# EAGLE design mainboard-mini (EAGLE 6.4)
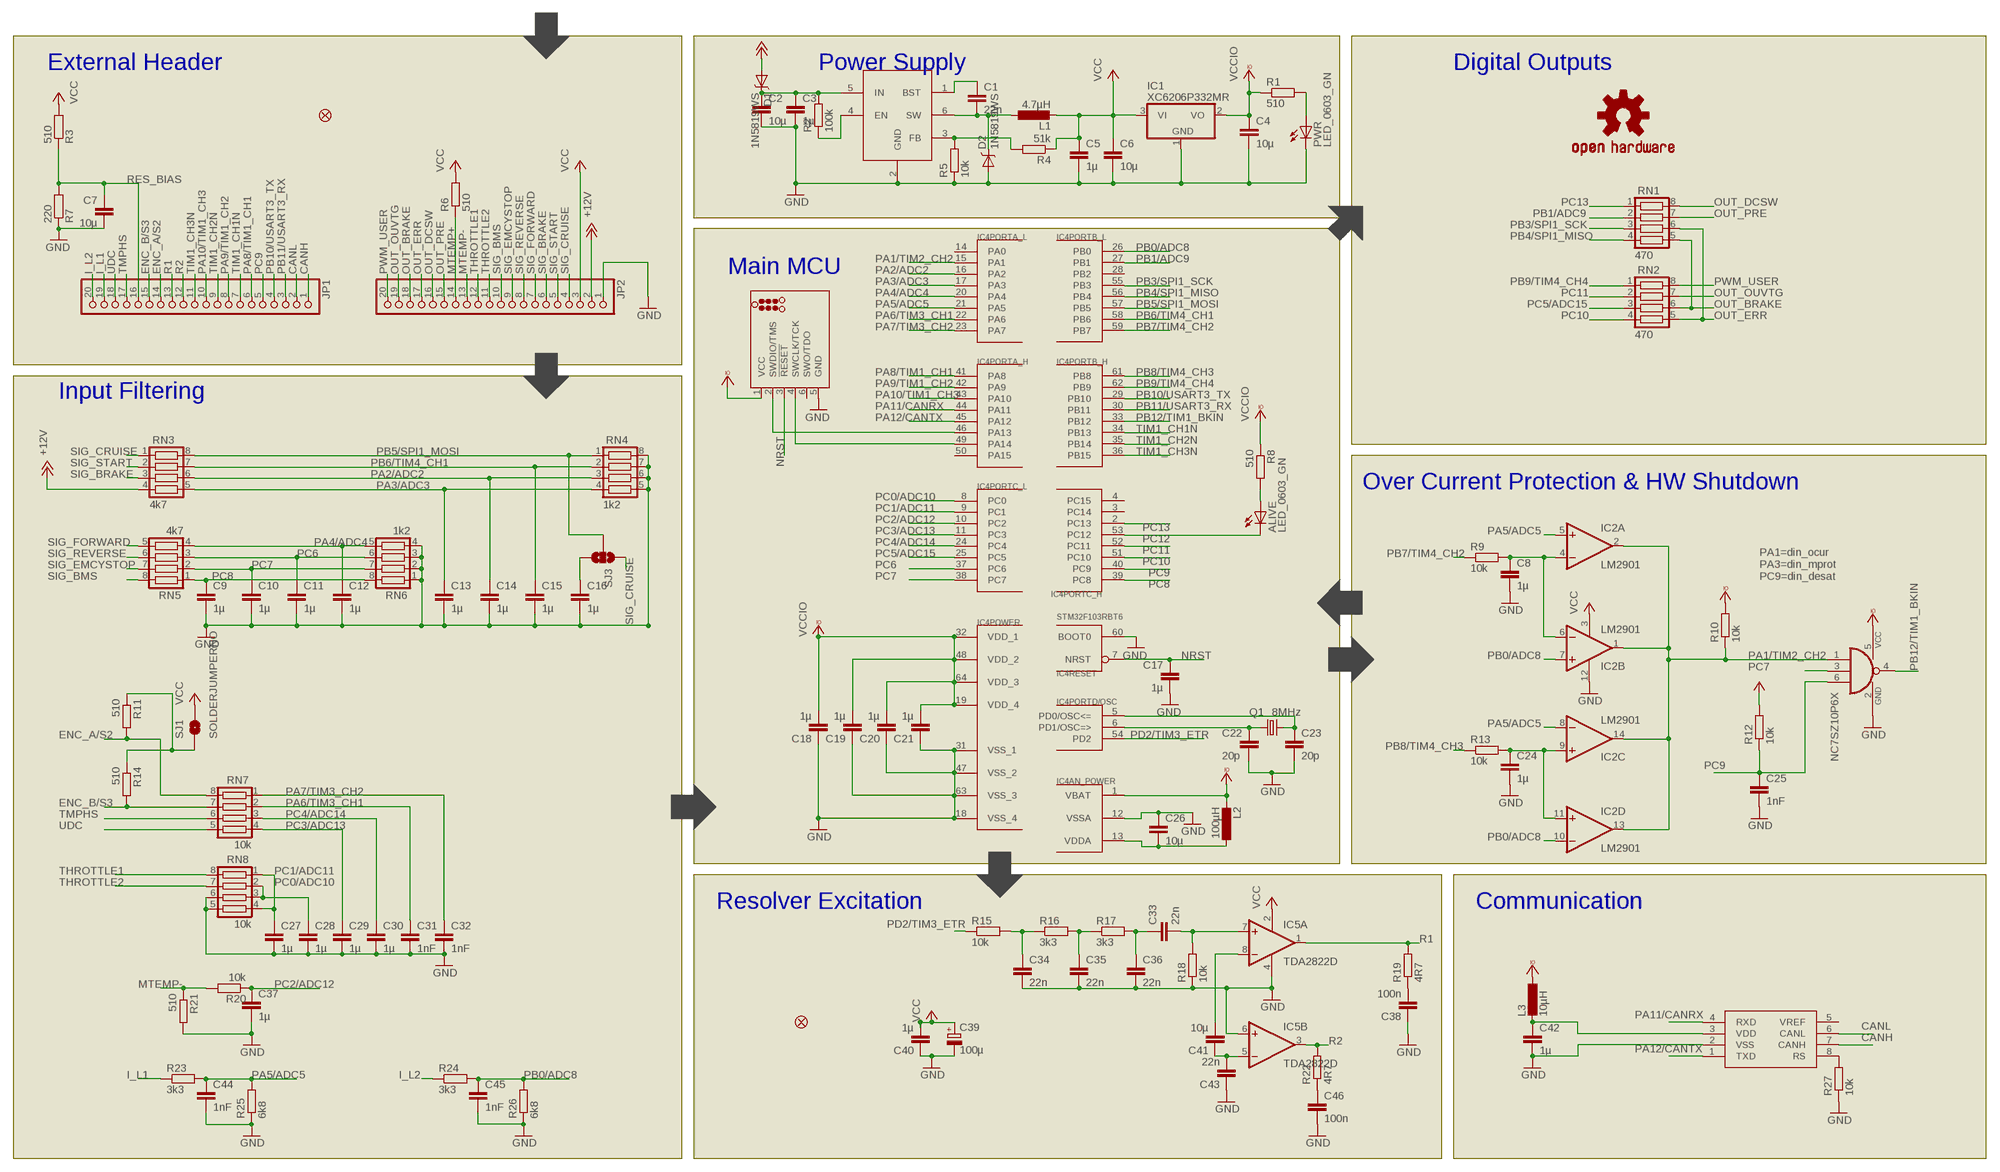
[diagram p0: schematic, sheet 1]

## Parts
ALIVE  LED_0603_GN  LEDSML0805  [SML0805]
C1  22n  C-EUC0603  [C0603]
C2  10µ  C-EUC0603  [C0603]
C3  1µ  C-EUC0603  [C0603]
C4  10µ  C-EUC0603  [C0603]
C5  1µ  C-EUC0603  [C0603]
C6  10µ  C-EUC0603  [C0603]
C7  10µ  C-EUC0603  [C0603]
C8  1µ  C-EUC0603  [C0603]
C9  1µ  C-EUC0603  [C0603]
C10  1µ  C-EUC0603  [C0603]
C11  1µ  C-EUC0603  [C0603]
C12  1µ  C-EUC0603  [C0603]
C13  1µ  C-EUC0603  [C0603]
C14  1µ  C-EUC0603  [C0603]
C15  1µ  C-EUC0603  [C0603]
C16  1µ  C-EUC0603  [C0603]
C17  1µ  C-EUC0603  [C0603]
C18  1µ  C-EUC0603  [C0603]
C19  1µ  C-EUC0603  [C0603]
C20  1µ  C-EUC0603  [C0603]
C21  1µ  C-EUC0603  [C0603]
C22  20p  C-EUC0603  [C0603]
C23  20p  C-EUC0603  [C0603]
C24  1µ  C-EUC0603  [C0603]
C25  1nF  C-EUC0603  [C0603]
C26  10µ  C-EUC0603  [C0603]
C27  1µ  C-EUC0603  [C0603]
C28  1µ  C-EUC0603  [C0603]
C29  1µ  C-EUC0603  [C0603]
C30  1µ  C-EUC0603  [C0603]
C31  1nF  C-EUC0603  [C0603]
C32  1nF  C-EUC0603  [C0603]
C33  22n  C-EUC0603  [C0603]
C34  22n  C-EUC0603  [C0603]
C35  22n  C-EUC0603  [C0603]
C36  22n  C-EUC0603  [C0603]
C37  1µ  C-EUC0603  [C0603]
C38  100n  C-EUC0603  [C0603]
C39  100µ  CPOL-EUB/3528-21R  [B/3528-21R]
C40  1µ  C-EUC0603  [C0603]
C41  10µ  C-EUC0603  [C0603]
C42  1µ  C-EUC0603  [C0603]
C43  22n  C-EUC0603  [C0603]
C44  1nF  C-EUC0603  [C0603]
C45  1nF  C-EUC0603  [C0603]
C46  100n  C-EUC0603  [C0603]
D1  1N5819WS  BAT20JFILM  [SOD-323]
D2  1N5819WS  BAT20JFILM  [SOD-323]
FID1  FIDUCIAL1X2.5  [FIDUCIAL-1X2.5]
FID2  FIDUCIAL1X2.5  [FIDUCIAL-1X2.5]
IC1  XC6206P332MR  MCP1703CB  [SOT23]
IC2  LM2901  LM339D  [SO14]
IC3  NC7SZ10P6X  741G10X  [SC70-6]
IC4  STM32F103RBT6  STM32F10XRXT6  [TQFP64]
IC5  TDA2822D  [SO08]
IC6  SN65HVD230  MCP2551  [SO08]
IC7  RT8259GE  MB2359DJ  [SOT23-6]
J1  TC2030_SWD-MCP  [TC2030-MCP]
JP1  PINHD-1X20  [1X20]
JP2  PINHD-1X20  [1X20]
L1  4.7µH  L-EUL2825P  [L2825P]
L2  100µH  L-EUL2012C  [L2012C]
L3  10µH  L-EUL2012C  [L2012C]
LOGO1  OSHW-LOGOM  [OSHW-LOGO-M]
PWR  LED_0603_GN  LEDSML0805  [SML0805]
Q1  8MHz  CRYSTALTXC-7A  [CRYSTAL-TXC-7A]
R1  510  R-EU_R0603  [R0603]
R2  100k  R-EU_R0603  [R0603]
R3  510  R-EU_R0603  [R0603]
R4  51k  R-EU_R0603  [R0603]
R5  10k  R-EU_R0603  [R0603]
R6  510  R-EU_R0603  [R0603]
R7  220  R-EU_R0603  [R0603]
R8  510  R-EU_R0603  [R0603]
R9  10k  R-EU_R0603  [R0603]
R10  10k  R-EU_R0603  [R0603]
R11  510  R-EU_R0603  [R0603]
R12  10k  R-EU_R0603  [R0603]
R13  10k  R-EU_R0603  [R0603]
R14  510  R-EU_R0603  [R0603]
R15  10k  R-EU_R0603  [R0603]
R16  3k3  R-EU_R0603  [R0603]
R17  3k3  R-EU_R0603  [R0603]
R18  10k  R-EU_R0603  [R0603]
R19  4R7  R-EU_R0603  [R0603]
R20  10k  R-EU_R0603  [R0603]
R21  510  R-EU_R0603  [R0603]
R22  4R7  R-EU_R0603  [R0603]
R23  3k3  R-EU_R0603  [R0603]
R24  3k3  R-EU_R0603  [R0603]
R25  6k8  R-EU_R0603  [R0603]
R26  6k8  R-EU_R0603  [R0603]
R27  10k  R-EU_R0603  [R0603]
RN1  470  CTS742C083  [CTS742C083]
RN2  470  CTS742C083  [CTS742C083]
RN3  4k7  CTS742C083  [CTS742C083]
RN4  1k2  CTS742C083  [CTS742C083]
RN5  4k7  CTS742C083  [CTS742C083]
RN6  1k2  CTS742C083  [CTS742C083]
RN7  10k  CTS742C083  [CTS742C083]
RN8  10k  CTS742C083  [CTS742C083]
SJ1  SOLDERJUMPERNO  [SJ_2S-NO]
SJ3  SOLDERJUMPER_2WAYPASTE2&3  [SJ_3_PASTE2&3]

## Nets
+12V: D1.2(A) JP2.2 RN3.4
CANH: IC6.7(CANH) JP1.1
CANL: IC6.6(CANL) JP1.2
ENC_A/S2: JP1.14 R11.2 RN7.8
ENC_B/S3: JP1.15 R14.2 RN7.7
GND: C2.2 C3.2 C4.2 C5.2 C6.2 C7.2 C8.2 C9.2 C10.2 C11.2 C12.2 C13.2 C14.2 C15.2 C16.2 C17.2 C18.1 C19.1 C20.1 C21.1 C22.2 C23.2 C24.2 C25.2 C26.1 C27.2 C28.2 C29.2 C30.2 C31.2 C32.2 C34.2 C35.2 C36.2 C37.2 C38.1 C39.- C40.1 C42.2 C43.1 C44.2 C45.2 C46.2 D2.2(A) IC1.1(GND) IC2.12(P:GND) IC3.2(PWR:GND) IC4.12(AN_POWER:VSSA) IC4.18(POWER:VSS_4) IC4.31(POWER:VSS_1) IC4.47(POWER:VSS_2) IC4.60(RESET:BOOT0) IC4.63(POWER:VSS_3) IC5.4(P:V-) IC5.6(B:+IN) IC6.2(VSS) IC7.2(GND) J1.5(GND) JP2.1 PWR.C R5.1 R7.1 R18.1 R21.2 R25.1 R26.1 R27.1 RN4.5 RN4.6 RN4.7 RN4.8 RN6.1 RN6.2 RN6.3 RN6.4 RN8.5 RN8.6
I_L1: JP1.19 R23.1
I_L2: JP1.20 R24.1
MTEMP+: JP2.14 R6.1
MTEMP-: JP2.13 R20.2 R21.1
N$1: C41.1 C43.2 IC5.5(B:-IN)
N$2: C22.1 IC4.6(PORTD/OSC:PD1/OSC=>) Q1.P$1
N$3: C2.1 C3.1 D1.1(C) IC7.5(IN) R2.2
N$4: C23.1 IC4.5(PORTD/OSC:PD0/OSC<=) Q1.P$2
N$5: C1.1 IC7.1(BST)
N$6: IC4.46(PORTA_H:PA13) J1.2(SWDIO/TMS)
N$7: C26.2 IC4.13(AN_POWER:VDDA) L2.1
N$8: IC7.4(EN) R2.1
N$9: IC4.49(PORTA_H:PA14) J1.4(SWCLK/TCK)
N$10: C24.1 IC2.9(C:+IN) IC2.11(D:+IN) R13.2
N$11: C38.2 R19.1
N$12: C41.2 IC5.8(A:-IN)
N$13: IC7.3(FB) R4.2 R5.2
N$14: C1.2 D2.1(C) IC7.6(SW) L1.1
N$15: C8.1 IC2.4(A:-IN) IC2.6(B:-IN) R9.2
N$16: C42.1 IC6.3(VDD) L3.2
N$17: C35.1 R16.2 R17.1
N$18: C33.1 C36.1 R17.2
N$19: C33.2 IC5.7(A:+IN) R18.2
N$20: R11.1 R14.1 SJ1.1
N$21: C16.1 SJ3.3
N$22: PWR.A R1.2
N$23: ALIVE.A R8.2
N$24: IC6.8(RS) R27.2
N$27: C46.1 R22.1
N$30: C34.1 R15.2 R16.1
NRST: C17.1 IC4.7(RESET:NRST) J1.3(!RESET)
OUT_BRAKE: JP2.18 RN1.5 RN2.6
OUT_DCSW: JP2.16 RN1.8
OUT_ERR: JP2.17 RN1.6 RN2.5
OUT_OUVTG: JP2.19 RN2.7
OUT_PRE: JP2.15 RN1.7
PA1/TIM2_CH2: IC2.1(B:OUT) IC2.2(A:OUT) IC2.13(D:OUT) IC2.14(C:OUT) IC3.1(>NAME:I0) IC4.15(PORTA_L:PA1) R10.1
PA2/ADC2: C14.1 IC4.16(PORTA_L:PA2) RN3.6 RN4.3
PA3/ADC3: C13.1 IC4.17(PORTA_L:PA3) RN3.5 RN4.4
PA4/ADC4: C12.1 IC4.20(PORTA_L:PA4) RN5.4 RN6.5
PA5/ADC5: C44.1 IC2.5(A:+IN) IC2.8(C:-IN) IC4.21(PORTA_L:PA5) R23.2 R25.2
PA6/TIM3_CH1: C31.1 IC4.22(PORTA_L:PA6) RN7.2
PA7/TIM3_CH2: C32.1 IC4.23(PORTA_L:PA7) RN7.1
PA8/TIM1_CH1: IC4.41(PORTA_H:PA8) JP1.6
PA9/TIM1_CH2: IC4.42(PORTA_H:PA9) JP1.8
PA10/TIM1_CH3: IC4.43(PORTA_H:PA10) JP1.10
PA11/CANRX: IC4.44(PORTA_H:PA11) IC6.4(RXD)
PA12/CANTX: IC4.45(PORTA_H:PA12) IC6.1(TXD)
PB0/ADC8: C45.1 IC2.7(B:+IN) IC2.10(D:-IN) IC4.26(PORTB_L:PB0) R24.2 R26.2
PB1/ADC9: IC4.27(PORTB_L:PB1) RN1.2
PB3/SPI1_SCK: IC4.55(PORTB_L:PB3) RN1.3
PB4/SPI1_MISO: IC4.56(PORTB_L:PB4) RN1.4
PB5/SPI1_MOSI: IC4.57(PORTB_L:PB5) RN3.8 RN4.1 SJ3.2
PB6/TIM4_CH1: C15.1 IC4.58(PORTB_L:PB6) RN3.7 RN4.2
PB7/TIM4_CH2: IC4.59(PORTB_L:PB7) R9.1
PB8/TIM4_CH3: IC4.61(PORTB_H:PB8) R13.1
PB9/TIM4_CH4: IC4.62(PORTB_H:PB9) RN2.1
PB10/USART3_TX: IC4.29(PORTB_H:PB10) JP1.4
PB11/USART3_RX: IC4.30(PORTB_H:PB11) JP1.3
PB12/TIM1_BKIN: IC3.4(>NAME:O) IC4.33(PORTB_H:PB12)
PC0/ADC10: C28.1 IC4.8(PORTC_L:PC0) RN8.2 RN8.3
PC1/ADC11: C27.1 IC4.9(PORTC_L:PC1) RN8.1 RN8.4
PC2/ADC12: C37.1 IC4.10(PORTC_L:PC2) R20.1
PC3/ADC13: C29.1 IC4.11(PORTC_L:PC3) RN7.4
PC4/ADC14: C30.1 IC4.24(PORTC_L:PC4) RN7.3
PC5/ADC15: IC4.25(PORTC_L:PC5) RN2.3
PC6: C11.1 IC4.37(PORTC_L:PC6) RN5.3 RN6.6
PC7: C10.1 IC3.3(>NAME:I1) IC4.38(PORTC_L:PC7) RN5.2 RN6.7
PC8: C9.1 IC4.39(PORTC_H:PC8) RN5.1 RN6.8
PC9: C25.1 IC3.6(>NAME:I2) IC4.40(PORTC_H:PC9) JP1.5 R12.1
PC10: IC4.51(PORTC_H:PC10) RN2.4
PC11: IC4.52(PORTC_H:PC11) RN2.2
PC12: ALIVE.C IC4.53(PORTC_H:PC12)
PC13: IC4.2(PORTC_H:PC13) RN1.1
PD2/TIM3_ETR: IC4.54(PORTD/OSC:PD2) R15.1
PWM_USER: JP2.20 RN2.8
R1: IC5.1(A:OUT) JP1.13 R19.2
R2: IC5.3(B:OUT) JP1.12 R22.2
RES_BIAS: C7.1 JP1.16 R3.1 R7.2
SIG_BMS: JP2.10 RN5.8
SIG_BRAKE: JP2.6 RN3.3
SIG_CRUISE: JP2.4 RN3.1 SJ3.1
SIG_EMCYSTOP: JP2.9 RN5.7
SIG_FORWARD: JP2.7 RN5.5
SIG_REVERSE: JP2.8 RN5.6
SIG_START: JP2.5 RN3.2
THROTTLE1: JP2.12 RN8.8
THROTTLE2: JP2.11 RN8.7
TIM1_CH1N: IC4.34(PORTB_H:PB13) JP1.7
TIM1_CH2N: IC4.35(PORTB_H:PB14) JP1.9
TIM1_CH3N: IC4.36(PORTB_H:PB15) JP1.11
TMPHS: JP1.17 RN7.6
UDC: JP1.18 RN7.5
VCC: C5.1 C6.1 C39.+ C40.2 IC1.3(VI) IC2.3(P:V+) IC5.2(P:V+) JP2.3 L1.2 R3.2 R4.1 R6.2 R12.2 SJ1.2
VCCIO: C4.1 C18.2 C19.2 C20.2 C21.2 IC1.2(VO) IC3.5(PWR:VCC) IC4.1(AN_POWER:VBAT) IC4.19(POWER:VDD_4) IC4.32(POWER:VDD_1) IC4.48(POWER:VDD_2) IC4.64(POWER:VDD_3) J1.1(VCC) L2.2 L3.1 R1.1 R8.1 R10.2
Unconnected: IC4.3(PORTC_H:PC14) IC4.4(PORTC_H:PC15) IC4.14(PORTA_L:PA0) IC4.28(PORTB_L:PB2) IC4.50(PORTA_H:PA15) IC6.5(VREF) J1.6(SWO/TDO)

## Notes on the sheet
- External Header | Power Supply | Digital Outputs
- Main MCU
- Input Filtering
- Over Current Protection & HW Shutdown
- PA1=din_ocur
  PA3=din_mprot
  PC9=din_desat
- Resolver Excitation | Communication

## Library data of the parts
ALIVE PWR = led:LED: LED OSRAM: - CHIPLED LG R971, LG N971, LY N971, LG Q971, LY Q971, LO R971, LY R971 LH N974, LH R974 LS Q976, LO Q976, LY Q976 LO Q996 - Hyper CHIPLED LW Q18S LB Q993, LB Q99A, LB R99A - SideLED LS A670, LO A670, LY A670, LG A670, LP A670 LB A673, LV A673, LT A673, LW A673 LH A674 LY A675 LS A676, LA A676, LO A676, LY A676, LW A676 LS A679, LY A679, LG A679 - Hyper Micro SIDELED® LS Y876, LA Y876, LO Y876, LY Y876 LT Y87S - SmartLED LW L88C, LW L88S LB L89C, LB L89S, LG L890 LS L89K, LO L89K, LY L89K LS L896, LA L896, LO L896, LY L896 - TOPLED LS T670, LO T670, LY T670, LG T670, LP T670 LSG T670, LSP T670, LSY T670, LOP T670, LYG T670 LG T671, LOG T671, LSG T671 LB T673, LV T673, LT T673, LW T673 LH T674 LS T676, LA T676, LO T676, LY T676, LB T676, LH T676, LSB T676, LW T676 LB T67C, LV T67C, LT T67C, LS T67K, LO T67K, LY T67K, LW E67C LS E67B, LA E67B, LO E67B, LY E67B, LB E67C, LV E67C, LT E67C LW T67C LS T679, LY T679, LG T679 LS T770, LO T770, LY T770, LG T770, LP T770 LB T773, LV T773, LT T773, LW T773 LH T774 LS E675, LA E675, LY E675, LS T675 LS T776, LA T776, LO T776, LY T776, LB T776 LHGB T686 LT T68C, LB T68C - Hyper Mini TOPLED® LB M676 - Mini TOPLED Santana® LG M470 LS M47K, LO M47K, LY M47K Source: http://www.osram.convergy.de LUXEON: - LUMILED® LXK2-PW12-R00, LXK2-PW12-S00, LXK2-PW14-U00, LXK2-PW14-V00 LXK2-PM12-R00, LXK2-PM12-S00, LXK2-PM14-U00 LXK2-PE12-Q00, LXK2-PE12-R00, LXK2-PE12-S00, LXK2-PE14-T00, LXK2-PE14-U00 LXK2-PB12-K00, LXK2-PB12-L00, LXK2-PB12-M00, LXK2-PB14-N00, LXK2-PB14-P00, LXK2-PB14-Q00 LXK2-PR12-L00, LXK2-PR12-M00, LXK2-PR14-Q00, LXK2-PR14-R00 LXK2-PD12-Q00, LXK2-PD12-R00, LXK2-PD12-S00 LXK2-PH12-R00, LXK2-PH12-S00 LXK2-PL12-P00, LXK2-PL12-Q00, LXK2-PL12-R00 Source: www.luxeon.com KINGBRIGHT: KA-3528ASYC Source: www.kingbright.com
C1-C38 C40-C46 = rcl:C-EU: CAPACITOR, European symbol
C39 = rcl:CPOL-EU: POLARIZED CAPACITOR, European symbol
D1 D2 = SparkFun-DiscreteSemi:BAT20JFILM: 23V, 1A Schottky diode, SOD-323 package; PROD_ID: DIO-11623; VALUE: BAT20JFILM
FID1 FID2 = SparkFun-Aesthetics:FIDUCIAL: Fiducial Alignment Points Various fiducial points for machine vision alignment.
IC1 = linear:MCP1703: 250 mA, 16V, Low Quiescent Current LDO Regulator Source: http://ww1.microchip.com/downloads/en/DeviceDoc/22049b.pdf
IC2 = linear:LM339: Low Power Low Offset Voltage Quad Comparators with open collector; LM139/LM239/LM339/LM2901/LM3302
IC3 = 74xx-eu:74*1G10: 3-input NAND gate
IC4 = stm32:STM32F10XRXT6: STM32F101/103 64pin LQFP
IC5 = st-microelectronics:TDA2822: OP AMP
IC6 = SparkFun-DigitalIC:MCP2551: CAN transceiver
IC7 = v-reg-micrel:MB2359
J1 = tag-connect:TC2030_SWD: ARM20-CTX 20-Pin to TC2030-IDC Adapter for Cortex 6-Pin (TC2030-IDC family) </catalog/6> Cortex SWD </catalog/9> Adapters </adaptors> <javascript:void(0);> The Tag-Connect ARM20-CTX adapter board allows our TC2030-IDC cables to be used for ARM SWD (Single Wire Debug) applications. Although intended for use with our patented TC2030-IDC (and TC2030-IDC-NL) Plug-of-Nails™ Cables, the adapter may be useful to people wishing to use 6-pin 0.1” ribbon headers on their PCB instead of the traditional 20-Pin header. Please note the TC2030-IDC <http://tag-connect.com/TC2030-IDC> or TC2030-IDC-NL <http://tag-connect.com/TC2030-IDC-NL> cable is purchased separately, the cables and Segger JLINK seen in the pictures are not included! Download the Datasheet here. <http://www.tag-connect.com/Materials/ARM20-CTX.pdf>
JP1 JP2 = pinhead:PINHD-1X20: PIN HEADER
L1-L3 = rcl:L-EU: INDUCTOR, European symbol
LOGO1 = SparkFun-Aesthetics:OSHW-LOGO: Open Source Hardware Logo This logo indicates the piece of hardware it is found on incorporates a OSHW license and/or adheres to the definition of open source hardware found here: http://freedomdefined.org/OSHW
Q1 = SparkFun-FreqCtrl:CRYSTAL: Various standard crystals. Proven footprints. Spark Fun Electronics SKU : COM-00534
R1-R27 = rcl:R-EU_: RESISTOR, European symbol
RN1-RN8 = resistor-net:CTS742C083: Chip Resistor Array 4 Single Resistor Source: http://www.ctscorp.com/components/Datasheets/CTSChipArrayDs.pdf; OC_FARNELL: unknown; OC_NEWARK: unknown
SJ1 = SparkFun-Passives:SOLDERJUMPER: Solder Jumper Standard SMD solder jumper. Used to automate production. Two varients : Normally Open and Normally Closed are the same, but have different paste layers. NC will have a large amount of paste and should jumper during reflow.
SJ3 = SparkFun-Passives:SOLDERJUMPER_2WAY: Solder Jumper 2 way solder jumper

## Board
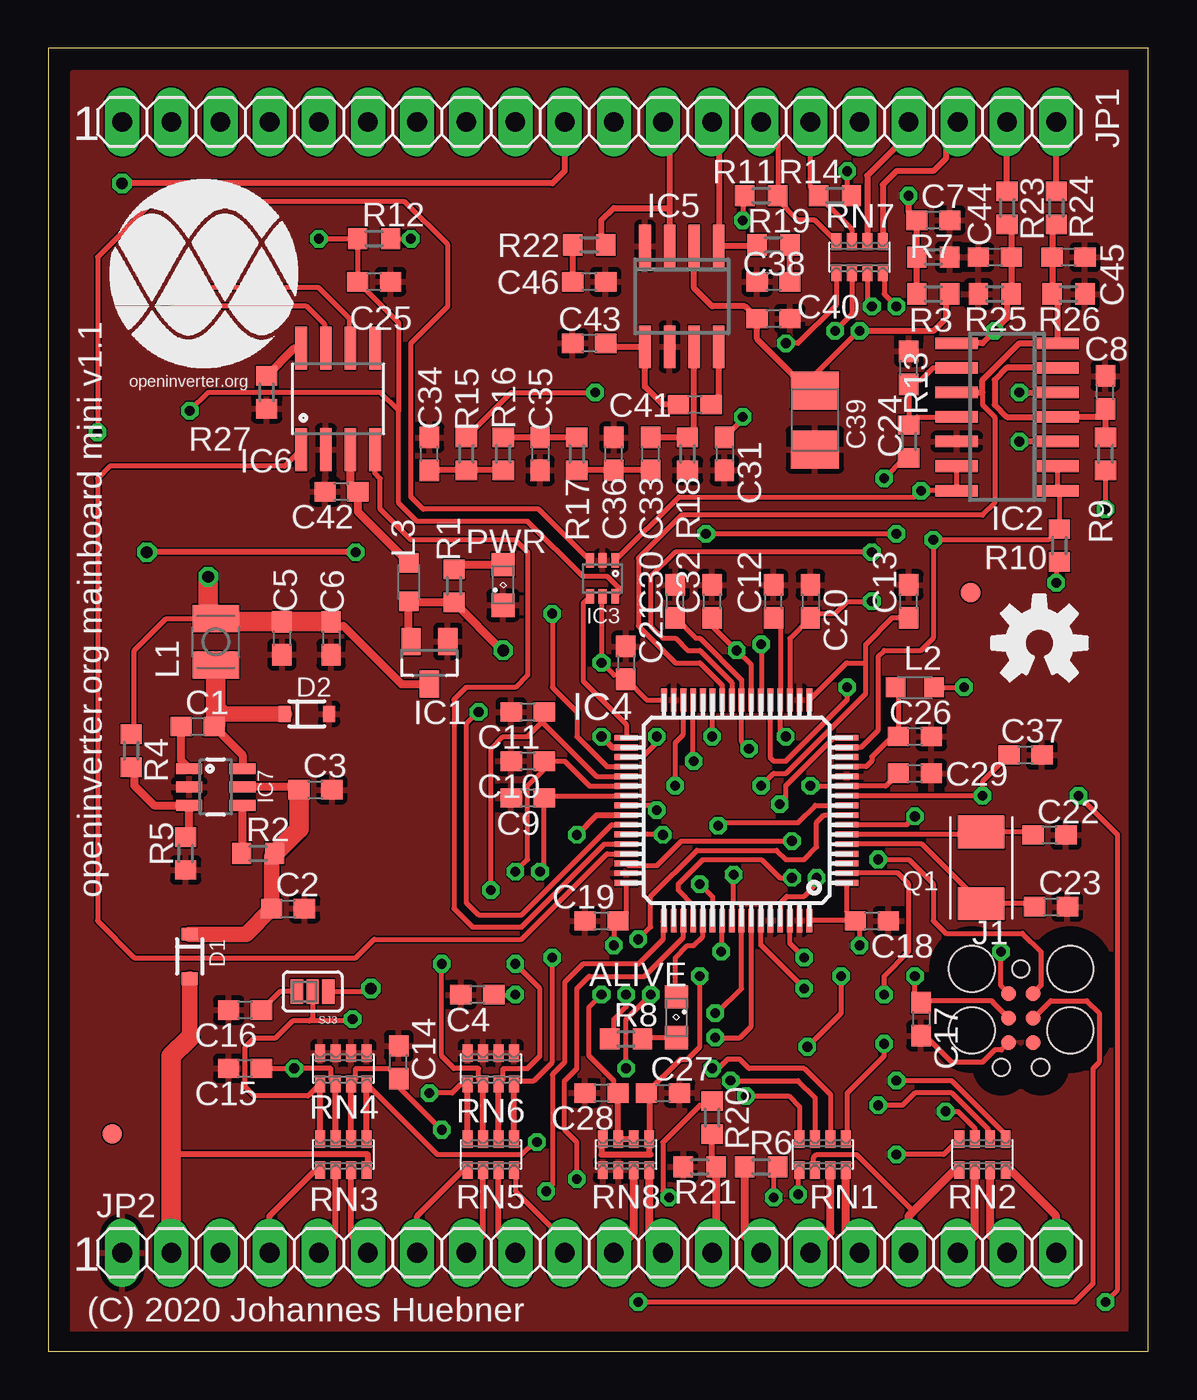
[diagram p1: board, top side]
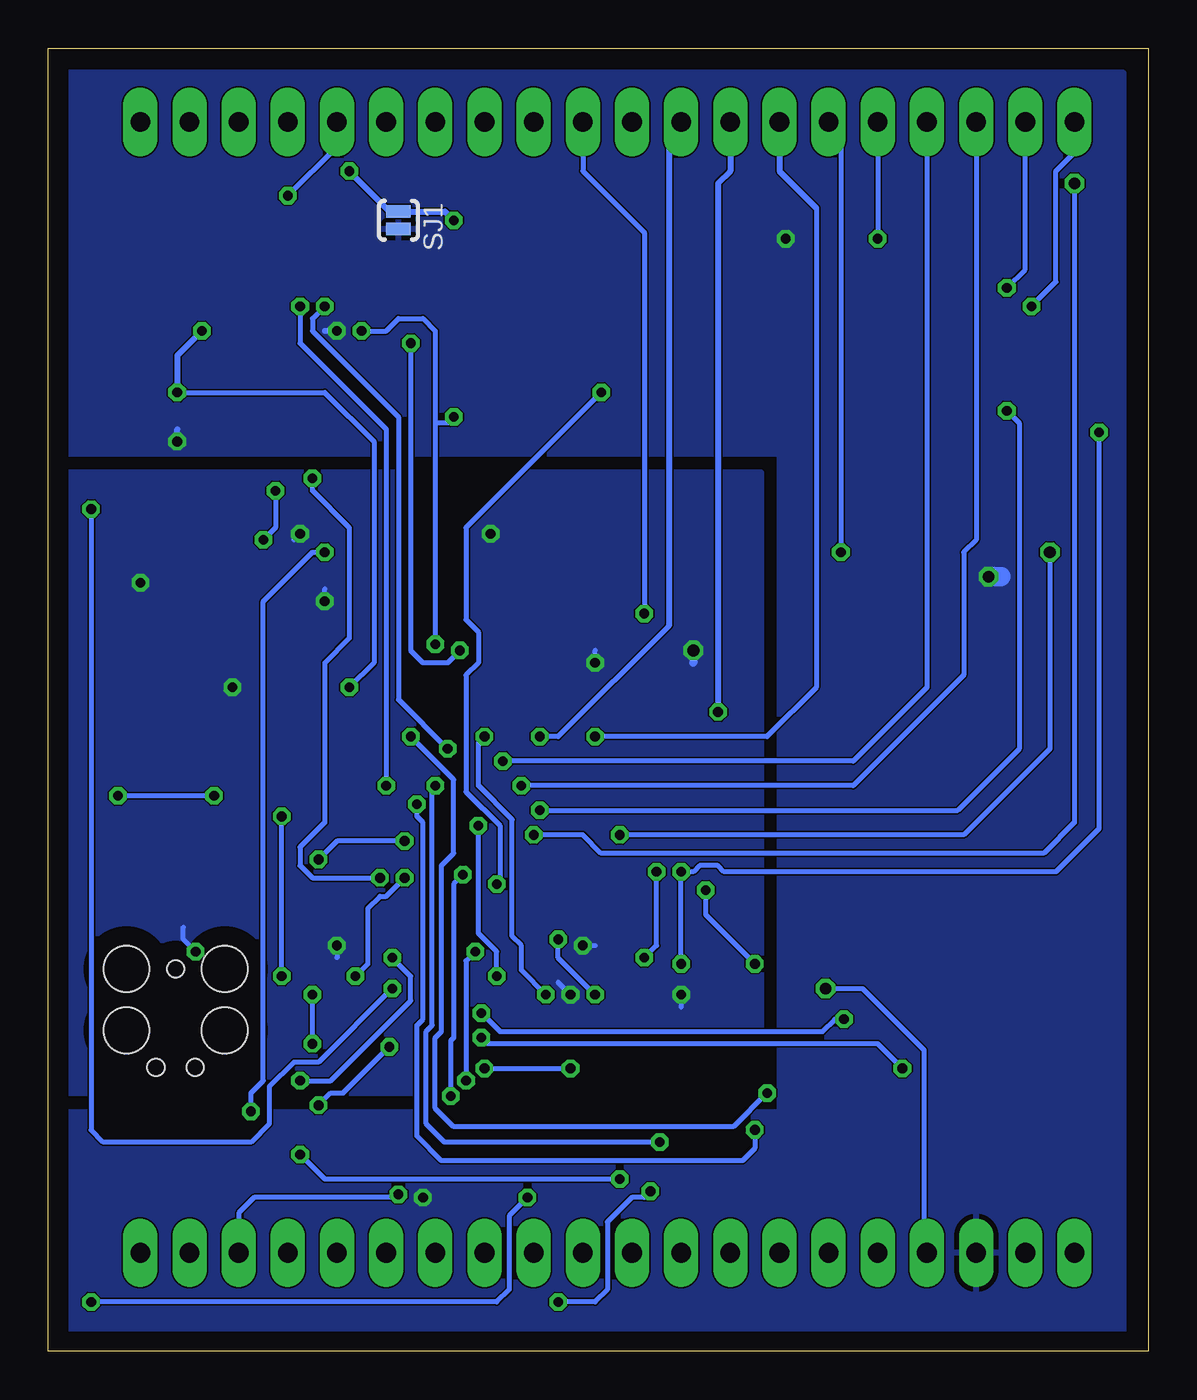
[diagram p2: board, bottom side, seen from below]

Size 56.82 x 67.3 mm. Coordinates in mm from the lower left corner, seen from the top.
Outline: 0,0 56.82,0 56.82,67.3 0,67.3 0,0
Copper layers (1*16): Top 0.035mm / dielectric 1.5mm / Bottom 0.035mm
Design rules "default *": minimum track width 10mil, minimum drill 0.5mm, track to track 3mil, track to pad 3mil, pad to pad 3mil, via to via 3mil, smd to smd 3mil, copper to edge 40mil, drill to drill 8mil, minimum pad ring 15mil, minimum via ring 8mil, stop-mask expansion 3mil, vias tented up to drill 0mil, thermal gap 10mil

### Footprints (pad centres in the part's own frame; a part is rotated, then mirrored left to right if it is on the bottom)
SML0805 = smd 1.2 x 1.2: A 1.05,0; C -1.05,0
C0603 = smd 1.1 x 1: 1 -0.85,0; 2 0.85,0
B/3528-21R = smd 1.95 x 2.5: + 1.525,0; - -1.525,0
SOD-323 = smd 0.63 x 0.83: 1 -1.15,0; 2 1.15,0
FIDUCIAL-1X2.5 = smd 1 x 1: 1 0,0
SOT23 = smd 1 x 1.4: 1 -0.95,-1.1; 2 0.95,-1.1; 3 0,1.1
SO14 = smd 0.6 x 2.2: 1 -3.81,-2.6; 2 -2.54,-2.6; 3 -1.27,-2.6; 4 0,-2.6; 5 1.27,-2.6; 6 2.54,-2.6; 7 3.81,-2.6; 8 3.81,2.6; 9 2.54,2.6; 10 1.27,2.6; 11 0,2.6; 12 -1.27,2.6; 13 -2.54,2.6; 14 -3.81,2.6
SC70-6 = smd 0.4 x 0.75: 1 -0.65,-0.925; 2 0,-0.925; 3 0.65,-0.925; 4 0.65,0.925; 5 0,0.925; 6 -0.65,0.925
TQFP64 = smd 1.2 x 0.3: 1 -5.7,3.75; 2 -5.7,3.25; 3 -5.7,2.75; 4 -5.7,2.25; 5 -5.7,1.75; 6 -5.7,1.25; 7 -5.7,0.75; 8 -5.7,0.25; 9 -5.7,-0.25; 10 -5.7,-0.75; 11 -5.7,-1.25; 12 -5.7,-1.75; 13 -5.7,-2.25; 14 -5.7,-2.75; 15 -5.7,-3.25; 16 -5.7,-3.75; 33 5.7,-3.75; 34 5.7,-3.25; 35 5.7,-2.75; 36 5.7,-2.25; 37 5.7,-1.75; 38 5.7,-1.25; 39 5.7,-0.75; 40 5.7,-0.25; 41 5.7,0.25; 42 5.7,0.75; 43 5.7,1.25; 44 5.7,1.75; 45 5.7,2.25; 46 5.7,2.75; 47 5.7,3.25; 48 5.7,3.75 | smd 0.3 x 1.2: 17 -3.75,-5.7; 18 -3.25,-5.7; 19 -2.75,-5.7; 20 -2.25,-5.7; 21 -1.75,-5.7; 22 -1.25,-5.7; 23 -0.75,-5.7; 24 -0.25,-5.7; 25 0.25,-5.7; 26 0.75,-5.7; 27 1.25,-5.7; 28 1.75,-5.7; 29 2.25,-5.7; 30 2.75,-5.7; 31 3.25,-5.7; 32 3.75,-5.7; 49 3.75,5.7; 50 3.25,5.7; 51 2.75,5.7; 52 2.25,5.7; 53 1.75,5.7; 54 1.25,5.7; 55 0.75,5.7; 56 0.25,5.7; 57 -0.25,5.7; 58 -0.75,5.7; 59 -1.25,5.7; 60 -1.75,5.7; 61 -2.25,5.7; 62 -2.75,5.7; 63 -3.25,5.7; 64 -3.75,5.7
SO08 = smd 0.6 x 2.2: 1 -1.905,-2.6; 2 -0.635,-2.6; 3 0.635,-2.6; 4 1.905,-2.6; 5 1.905,2.6; 6 0.635,2.6; 7 -0.635,2.6; 8 -1.905,2.6
SO08' = smd 0.61 x 2.21: 1 -1.905,-2.616; 2 -0.635,-2.616; 3 0.635,-2.616; 4 1.905,-2.616; 5 1.905,2.616; 6 0.635,2.616; 7 -0.635,2.616; 8 -1.905,2.616
SOT23-6 = smd 0.55 x 1.35: 1 -0.95,-1.375; 2 0,-1.375; 3 0.95,-1.375; 4 0.95,1.375; 5 0,1.375; 6 -0.95,1.375
TC2030-MCP = smd 0.787 x 0.787: 1 1.27,-0.635; 2 1.27,0.635; 3 2.54,-0.635; 4 2.54,0.635; 5 3.81,-0.635; 6 3.81,0.635 | hole 0.889: 0,0; 5.08,-1.016; 5.08,1.016 | hole 2.375: 0,2.54; 0,-2.54; 3.175,-2.54; 3.175,2.54
1X20 = drill 1.016 long: 1 -24.13,0; 2 -21.59,0; 3 -19.05,0; 4 -16.51,0; 5 -13.97,0; 6 -11.43,0; 7 -8.89,0; 8 -6.35,0; 9 -3.81,0; 10 -1.27,0; 11 1.27,0; 12 3.81,0; 13 6.35,0; 14 8.89,0; 15 11.43,0; 16 13.97,0; 17 16.51,0; 18 19.05,0; 19 21.59,0; 20 24.13,0
L2825P = smd 1.4 x 2.4: 1 -1.2,0; 2 1.2,0
L2012C = smd 1 x 1: 1 -1,0; 2 1,0
CRYSTAL-TXC-7A = smd 1.7 x 2.4: P$1 1.85,0; P$2 -1.85,0
R0603 = smd 1 x 1.1: 1 -0.85,0; 2 0.85,0
CTS742C083 = smd 0.5 x 0.9: 1 -1.2,-0.8; 2 -0.4,-0.8; 3 0.4,-0.8; 4 1.2,-0.8; 5 1.2,0.8; 6 0.4,0.8; 7 -0.4,0.8; 8 -1.2,0.8
SJ_2S-NO = smd 0.635 x 1.27: 1 -0.45,0; 2 0.45,0
SJ_3_PASTE2&3 = smd 0.635 x 1.27: 1 -0.813,0; 2 0,0; 3 0.813,0

### Placement (x,y rotation side)
ALIVE  32.45,17.25 270 top
C1  7.71,32.27 0 top
C2  12.38,22.86 0 top
C3  13.8,29 0 top
C4  22.16,18.41 180 top
C5  12.06,36.83 270 top
C6  14.61,36.83 270 top
C7  45.72,58.42 0 top
C8  54.61,49.53 90 top
C9  24.77,28.57 180 top
C10  24.77,30.48 180 top
C11  24.77,33.02 180 top
C12  37.47,38.73 90 top
C13  44.45,38.73 90 top
C14  18.1,14.92 90 top
C15  10.16,14.61 180 top
C16  10.16,17.62 180 top
C17  45.09,17.14 270 top
C18  42.55,22.23 180 top
C19  28.57,22.23 0 top
C20  39.37,38.73 270 top
C21  29.84,35.56 270 top
C22  51.73,26.67 0 top
C23  51.8,22.95 0 top
C24  44.45,50.8 90 top
C25  16.83,55.24 0 top
C26  44.77,31.75 180 top
C27  31.75,13.34 0 top
C28  28.57,13.34 180 top
C29  44.77,29.84 0 top
C30  32.38,38.73 90 top
C31  34.92,46.35 270 top
C32  34.29,38.73 90 top
C33  31.11,46.35 90 top
C34  19.68,46.35 90 top
C35  25.4,46.35 270 top
C36  29.21,46.35 90 top
C37  50.48,30.8 0 top
C38  37.47,55.24 0 top
C39  39.6,48.1 90 top
C40  37.47,53.34 180 top
C41  33.4,48.9 0 top
C42  15.14,44.4 180 top
C43  27.94,52.07 0 top
C44  48.9,56.52 180 top
C45  52.7,56.52 0 top
C46  27.94,55.24 0 top
D1  7.3,20.39 270 top
D2  13.36,32.92 0 top
FID1  3.29,11.22 0 top
FID2  47.65,39.18 0 top
IC1  19.68,35.56 180 top
IC2  49.53,48.26 90 top
IC3  28.63,39.92 180 top
IC4  35.56,27.94 180 top
IC5  32.73,54.49 180 top
IC6  SN65HVD230  [SO08']  14.97,49.2 0 top
IC7  8.65,29.14 270 top
J1  50.25,19.74 270 top
JP1  27.94,63.5 0 top
JP2  27.94,5.08 0 top
L1  8.65,36.64 90 top
L2  44.77,34.29 0 top
L3  18.62,39.73 90 top
LOGO1  51.2,36.58 0 top
PWR  23.49,39.59 90 top
Q1  48.2,24.96 90 top
R1  20.96,39.54 90 top
R2  10.84,25.7 0 top
R3  45.72,54.61 0 top
R4  4.28,31.02 270 top
R5  7.09,25.7 90 top
R6  36.83,9.53 0 top
R7  45.72,56.52 180 top
R8  29.84,16.13 0 top
R9  54.61,46.35 90 top
R10  52.23,41.62 270 top
R11  36.83,59.69 0 top
R12  16.83,57.47 0 top
R13  44.45,46.99 90 top
R14  40.64,59.69 180 top
R15  21.59,46.35 270 top
R16  23.5,46.35 90 top
R17  27.3,46.35 270 top
R18  33.02,46.35 90 top
R19  37.47,57.15 180 top
R20  34.29,12.06 270 top
R21  33.66,9.53 180 top
R22  27.94,57.15 0 top
R23  49.53,59.05 270 top
R24  52.07,59.05 270 top
R25  48.9,54.61 0 top
R26  52.7,54.61 180 top
R27  11.27,49.53 90 top
RN1  40.01,10.16 180 top
RN2  48.26,10.16 180 top
RN3  15.24,10.16 0 top
RN4  15.24,14.61 0 top
RN5  22.86,10.16 180 top
RN6  22.86,14.61 180 top
RN7  41.91,56.52 0 top
RN8  29.84,10.16 180 top
SJ1  38.73,58.42 270 bottom
SJ3  13.65,18.57 180 top
U$2  [OI_LOGO]  3.17,50.8 0 top

### Tracks (layer width: path | path; a pad name or v marks a point on that pad's centre or on a via)
+12V
  Top 0.305: RN3.4 16.51,9.43 16.51,10.16 6.35,10.16
  Top 0.813: 7.3,16.19 D1.2
  Top 1.016: JP2.2 6.35,10.16 6.35,15.24 7.3,16.19
CANH  (via drill 0.5)
  Top 0.254: IC6.7 14.29,51.86 14.29,53.02 13.34,53.98 v6.03,53.98
  Bottom 0.254: v6.03,53.98 4.76,55.24 4.76,60.96 3.81,61.91 JP1.1
CANL  (via drill 0.5)
  Top 0.254: IC6.6 15.56,51.86 15.56,53.34 13.97,54.93 v7.3,54.93
  Bottom 0.254: v7.3,54.93 6.35,55.88 JP1.2
ENC_A/S2
  Top 0.254: JP1.14 37.68,62.65 R11.2 37.68,59.48 38.73,58.42 39.6,58.42 RN7.8
ENC_B/S3
  Top 0.254: JP1.15 39.37,60.11 R14.2 41.51,57.97 RN7.7
GND
  Top 0.254: J1.5 49.24,15.56 48.9,15.56 48.26,14.92 46.67,14.92 45.3,16.3 C17.2
  pour Top: 1.27,66.04 55.88,66.04 55.88,0.64 1.27,0.64
I_L1
  Top 0.305: R23.1 JP1.19
I_L2
  Top 0.305: R24.1 JP1.20
MTEMP+
  Top 0.406: JP2.14 35.98,5.93 R6.1
MTEMP-
  Top 0.305: R21.1 34.29,9.74 R20.2
  Top 0.406: JP2.13 34.51,5.29 R21.1
N$1
  Top 0.305: C43.2 28.97,51.89 IC5.5 30.82,49.82 31.75,48.9 C41.1
N$2
  Top 0.254: IC4.6 48.07,26.69 Q1.P$1 50.73,26.82 C22.1
N$3
  Top 0.406: C3.1 12.8,29.14 IC7.5
  Top 0.813: R2.2 11.53,25.55 C2.1 10.21,21.54 D1.1
  Top 1.016: R2.2 12.95,26.96 C3.1
N$4
  Top 0.254: IC4.5 45.12,26.19 Q1.P$2 50.78,23.11 C23.1
N$5
  Top 0.406: IC7.1 6.86,30.5 C1.1
N$6  (via drill 0.5)
  Top 0.254: IC4.46 29.97,25.08 31.43,25.08 32.7,26.35 v38.42,26.35 | v42.86,25.4 44.45,25.4 45.72,24.13 45.72,22.23 46.35,21.59 50.32,21.59 51.28,20.64 51.28,18.89 50.88,18.5 J1.2
  Bottom 0.254: v38.42,26.35 41.91,26.35 v42.86,25.4
N$7
  Top 0.254: L2.1 43.92,34.14 C26.2 43.6,31.75 42.55,30.7 42.55,30.48 42.26,30.19 IC4.13
N$8
  Top 0.406: R2.1 10.03,25.74 IC7.4
N$9  (via drill 0.5)
  Top 0.254: IC4.49 31.75,22.18 31.75,21.27 30.48,20 27.62,20 26.67,19.05 26.67,14.92 26.04,14.29 26.04,8.57 v25.72,8.26 | v30.48,2.54 53.02,2.54 53.98,3.49 53.98,14.61 54.29,14.92 54.29,17.46 53.66,18.1 51.78,18.1 J1.4
  Bottom 0.254: v25.72,8.26 26.04,7.94 26.67,7.94 27.94,6.67 27.94,3.17 28.57,2.54 v30.48,2.54
N$10
  Top 0.254: IC2.9 45.72,50.8 45.09,50.16 44.66,50.16 C24.1 R13.2 44.87,48.26 IC2.11
N$11
  Top 0.305: C38.2 R19.1
N$12
  Top 0.305: C41.2 34.63,49.4 IC5.8
N$13
  Top 0.406: R5.2 7.28,26.74 IC7.3 5.46,28.19 4.45,29.21 4.45,30 R4.2
N$14
  Top 0.406: C1.2 10.03,30.8 IC7.6
  Top 0.813: D2.1 9.07,32.92 8.65,33.34
  Top 1.016: C1.2 8.65,32.35 8.65,33.34 L1.1
N$15
  Top 0.305: IC2.6 49.53,50.8 48.9,50.16 48.9,48.9 49.53,48.26 IC2.4 54.19,48.26 C8.1 R9.2
N$16
  Top 0.406: L3.2 15.99,43.36 C42.1 15.6,44.79 IC6.3
N$17
  Top 0.305: R17.1 C35.1 R16.2
N$18
  Top 0.305: C33.1 C36.1 R17.2
N$19
  Top 0.305: IC5.7 33.36,47.55 R18.2 C33.2
N$20  (via drill 0.5)
  Top 0.254: R14.1 41.27,59.91 v41.27,60.96 | R11.1 35.88,59.59 v35.88,58.42
  Bottom 0.254: v41.27,60.96 41.27,61.28 | v35.88,58.42 35.88,58.1
  Bottom 0.305: v41.27,60.96 39.19,58.87 SJ1.1 36.33,58.87 v35.88,58.42
N$21
  Top 0.254: SJ3.3 11.96,18.57 C16.1
N$22
  Top 0.406: R1.2 21.2,40.63 PWR.A
N$23
  Top 0.254: R8.2 30.76,16.2 ALIVE.A
N$24
  Top 0.406: R27.2 12.7,51.81 IC6.8
N$27
  Top 0.305: R22.1 C46.1
N$30
  Top 0.305: R16.1 R15.2 C34.1
NRST  (via drill 0.5)
  Top 0.254: J1.3 48.82,18 48.82,18.02 48.74,18.1 45.19,18.1 C17.1 44.77,18.31 v44.77,19.37 | v44.77,27.62 44.34,27.19 IC4.7
  Bottom 0.254: v44.77,19.37 v44.77,27.62
OUT_BRAKE  (via drill 0.5)
  Top 0.254: RN1.5 38.73,9.29 v38.73,8.1
  Top 0.406: JP2.18 47.86,5.95 RN2.6
  Bottom 0.254: v38.73,8.1 38.89,7.94 46.2,7.94 46.99,7.14 JP2.18
OUT_DCSW
  Top 0.406: JP2.16 41.2,5.79 RN1.8
OUT_ERR
  Top 0.254: RN1.6 39.53,9.44 39.53,10 39.69,10.16 41.75,10.16 44.61,7.3 44.77,7.3
  Top 0.406: JP2.17 44.45,6.99 44.77,7.3 46.83,9.36 RN2.5
OUT_OUVTG
  Top 0.406: JP2.19 48.66,5.95 RN2.7
OUT_PRE
  Top 0.406: JP2.15 40.41,6.12 RN1.7
PA1/TIM2_CH2  (via drill 0.5)
  Top 0.254: IC2.13 IC2.14 v45.09,44.45 44.77,44.13 32.57,44.13 IC3.1 | IC4.15 41.98,31.19 42.86,32.07 42.86,35.88 43.18,36.2 45.09,36.2 45.72,36.83 v45.72,41.91 51.67,41.91 R10.1 52.23,44.35 IC2.1 IC2.2
  Bottom 0.254: v45.09,44.45 45.09,42.55 v45.72,41.91
PA2/ADC2  (via drill 0.5)
  Top 0.254: RN4.3 15.88,14.04 15.88,14.61 17.57,14.61 C14.1 18.1,13.65 v20.32,11.43 | v37.78,28.26 38.1,28.57 38.1,29.21 40.58,31.69 IC4.16
  Top 0.305: RN3.6 RN4.3
  Bottom 0.254: v20.32,11.43 20.32,10.48 20.95,9.84 36.51,9.84 37.78,11.11 37.78,16.83 37.47,17.14 37.47,27.3 37.78,27.62 v37.78,28.26
PA3/ADC3  (via drill 0.5)
  Top 0.254: RN4.4 20.09,10.16 24.45,10.16 25.08,10.79 v25.24,10.79 | v36.83,29.21 37.47,29.84 38.1,29.84 42.23,33.97 42.23,35.56 | 42.23,35.56 42.23,36.51 43.6,37.88 C13.1 | IC4.17 41.23,35.56 42.23,35.56
  Top 0.305: RN3.5 RN4.4
  Bottom 0.254: v25.24,10.79 36.35,10.79 37.31,11.75 37.31,16.51 36.99,16.83 36.99,29.05 v36.83,29.21
PA4/ADC4  (via drill 0.5)
  Top 0.254: C12.1 37.81,37.54 IC4.20 37.81,32.04 v38.1,31.75 | v19.68,13.34 20.86,13.34 21.33,13.8 RN6.5
  Top 0.305: RN5.4 RN6.5
  Bottom 0.254: v19.68,13.34 21.43,11.59 35.88,11.59 36.83,12.54 36.83,16.19 36.51,16.51 36.51,25.08 35.88,25.72 35.88,29.53 v38.1,31.75
PA5/ADC5  (via drill 0.5)
  Top 0.254: IC4.21 37.31,30.64 37.47,30.48 38.1,30.48 41.27,33.66 v41.27,34.29
  Top 0.305: R23.2 49.74,57.99 C44.1 R25.2 49.53,54.4 49.53,53.34 v48.9,52.7 48.26,52.07 IC2.8 | v50.16,49.53 IC2.5
  Bottom 0.254: v50.16,49.53 42.55,49.53 40.01,46.99 40.01,35.56 v41.27,34.29
  Bottom 0.305: v48.9,52.7 50.16,51.44 v50.16,49.53
PA6/TIM3_CH1  (via drill 0.5)
  Top 0.254: RN7.2 41.51,53.58 v40.64,52.7 | v36.83,36.51 36.83,33.66 IC4.22 | C31.1 35.88,48.16 v35.88,48.26
  Bottom 0.254: v40.64,52.7 39.37,52.7 38.73,53.34 37.47,53.34 36.83,52.7 36.83,47.94 | 36.83,47.94 v36.83,36.51 | v35.88,48.26 36.2,47.94 36.83,47.94
PA7/TIM3_CH2  (via drill 0.5)
  Top 0.254: RN7.1 40.71,54.05 38.73,52.07 v38.1,52.07 | IC4.23 36.31,35.45 v35.56,36.2 34.29,37.47 C32.1
  Bottom 0.254: v38.1,52.07 38.1,36.2 37.47,35.56 36.2,35.56 v35.56,36.2
PA8/TIM1_CH1  (via drill 0.5, 0.6)
  Top 0.305: v15.88,41.27 v5.08,41.27 | v27.3,26.67 28.32,27.69 IC4.41
  Bottom 0.254: 15.88,62.87 v15.88,41.27 | v5.08,41.27 5.08,31.11 9.53,26.67 v27.3,26.67
  Bottom 0.305: JP1.6 15.88,62.87
PA9/TIM1_CH2  (via drill 0.5)
  Top 0.254: v22.23,33.02 21.59,32.38 21.59,23.18 22.23,22.54 24.45,22.54 29.09,27.19 IC4.42
  Bottom 0.305: JP1.8 21.59,60.96 22.23,60.33 v22.23,33.02
PA10/TIM1_CH3  (via drill 0.5, 0.6)
  Top 0.254: 31.73,26.69 IC4.43
  Top 0.305: JP1.10 26.67,60.96 26.04,60.33 v3.81,60.33 | v31.75,26.67 31.73,26.69
  Bottom 0.254: v3.81,60.33 3.81,27.3 5.4,25.72 28.26,25.72 29.21,26.67 v31.75,26.67
PA11/CANRX
  Top 0.254: IC4.44 28.73,26.19 24.45,21.91 21.91,21.91 20.95,22.86 20.95,33.66 21.59,34.29 24.13,34.29 24.77,34.92 24.77,41.27 24.13,41.91 18.73,41.91 17.14,43.5 17.14,45.09 16.87,45.36 IC6.4
PA12/CANTX
  Top 0.254: IC6.1 12.2,45.72 3.17,45.72 2.54,45.09 2.54,22.23 4.45,20.32 15.88,20.32 16.83,21.27 24.45,21.27 28.86,25.69 IC4.45
PB0/ADC8
  Top 0.254: 48.26,49.53 48.26,48.9 48.9,48.26 48.9,43.81 48.26,43.18 32.7,43.18 30.48,40.96 30.48,37.47 32.38,35.56 33.66,35.56 34.81,34.41 IC4.26
  Top 0.305: R24.2 51.85,57.99 C45.1 R26.2 52.13,54.34 IC2.7 50.16,52.07 48.26,50.16 48.26,49.53 IC2.10
PB1/ADC9  (via drill 0.5)
  Top 0.254: v34.29,14.61 34.61,14.61 35.08,15.08 35.72,15.08 36.2,14.61 39.05,14.61 40.41,13.25 RN1.2 | v29.84,14.61 29.84,17.14 v31.11,18.41 | v34.29,31.75 34.31,31.77 IC4.27
  Bottom 0.254: v34.29,14.61 v29.84,14.61 | v34.29,31.75 34.61,31.43 34.61,29.21 32.86,27.46 32.86,21.43 32.38,20.95 32.38,19.68 v31.11,18.41
PB3/SPI1_SCK  (via drill 0.5)
  Top 0.254: v34.77,20.64 34.81,20.68 IC4.55 | v35.24,13.97 38.73,13.97 39.6,13.1 RN1.3
  Bottom 0.254: v34.77,20.64 35.24,20.16 v35.24,13.97
PB4/SPI1_MISO  (via drill 0.5)
  Top 0.254: v35.4,24.61 35.4,23.18 35.31,23.09 IC4.56 | v36.04,13.18 38.26,13.18 38.8,12.63 RN1.4
  Bottom 0.254: v35.4,24.61 35.88,24.13 35.88,16.19 36.04,16.03 v36.04,13.18
PB5/SPI1_MOSI  (via drill 0.5)
  Top 0.254: IC4.57 35.81,18.72 34.55,17.46 v34.45,17.46 | RN4.1 13.41,13.18 10.64,13.18 10.16,13.65 10.16,15.72 10.64,16.19 11.75,16.19 12.61,17.05 13.49,17.05 | v15.72,17.14 15.62,17.05 13.49,17.05 | SJ3.2 13.65,17.21 13.49,17.05
  Top 0.305: RN3.8 RN4.1
  Bottom 0.254: v34.45,17.46 33.5,16.51 16.83,16.51 16.19,17.14 v15.72,17.14
PB6/TIM4_CH1  (via drill 0.5)
  Top 0.254: RN4.2 14.61,14.04 14.61,14.61 v12.7,14.61 C15.1 | v34.45,16.19 35.72,16.19 36.31,16.78 IC4.58
  Top 0.305: RN3.7 RN4.2
  Bottom 0.254: v12.7,14.61 13.97,15.88 34.13,15.88 v34.45,16.19
PB7/TIM4_CH2  (via drill 0.5)
  Top 0.254: R9.1 v54.61,43.5 | v39.05,18.73 36.81,20.98 IC4.59
  Bottom 0.254: v54.61,43.5 54.61,11.43 53.98,10.79 46.35,10.79 45.4,11.75 45.4,13.65 44.13,14.92 42.86,14.92 v39.05,18.73
PB8/TIM4_CH3  (via drill 0.5)
  Top 0.254: IC4.61 37.81,23.15 38.16,23.5 39.05,23.5 39.69,24.13 v39.69,24.45 | v43.18,45.09 44.23,46.14 R13.1
  Bottom 0.254: v43.18,45.09 43.18,44.45 41.27,42.55 41.27,36.83 42.55,35.56 42.55,27.3 43.81,26.04 43.81,25.08 43.18,24.45 v39.69,24.45
PB9/TIM4_CH4  (via drill 0.5)
  Top 0.254: v43.81,13.97 46.67,13.97 49.46,11.18 RN2.1 | v39.05,20.32 38.31,21.06 IC4.62
  Bottom 0.254: v43.81,13.97 42.23,13.97 38.1,18.1 38.1,19.37 v39.05,20.32
PB10/USART3_TX  (via drill 0.5)
  Top 0.254: v33.34,30.48 33.31,30.82 IC4.29
  Bottom 0.254: JP1.4 11.43,34.29 15.24,30.48 v33.34,30.48
PB11/USART3_RX  (via drill 0.5)
  Top 0.254: v32.38,29.21 32.38,31.43 32.81,31.86 IC4.30
  Bottom 0.254: JP1.3 8.89,41.91 9.53,41.27 9.53,34.92 15.24,29.21 v32.38,29.21
PB12/TIM1_BKIN
  Top 0.254: IC3.4 27.62,38.63 27.62,34.61 29.86,32.37 IC4.33
PC0/ADC10  (via drill 0.5)
  Top 0.254: C28.1 29.21,13.55 29.21,13.97 27.94,15.24 27.94,17.78 v28.57,18.41 | v30.48,21.27 31.11,21.91 31.11,23.5 33.5,25.88 37.62,25.88 38.1,25.4 39.05,25.4 39.69,26.04 39.69,27.3 40.07,27.69 IC4.8
  Top 0.305: RN8.2 RN8.3 29.43,10.98 C28.1
  Bottom 0.254: v28.57,18.41 30.48,20.32 v30.48,21.27
PC1/ADC11  (via drill 0.5)
  Top 0.254: C27.1 32.65,15.08 33.02,15.08 33.66,15.72 v33.66,19.37 | v34.61,27.15 34.77,27.3 38.73,27.3 39.62,28.19 IC4.9
  Top 0.305: RN8.4 28.57,10.89 28.57,10.16 31.11,10.16 31.05,10.23 RN8.1 31.05,13.19 C27.1
  Bottom 0.254: v33.66,19.37 33.66,20.64 34.61,21.59 v34.61,27.15
PC2/ADC12  (via drill 0.5)
  Top 0.254: v32.07,7.94 31.75,8.26 31.75,10.79 33.66,12.7 34.08,12.7 R20.1 | v54.61,2.54 55.24,3.17 55.24,26.67 v53.23,28.69 | IC4.10 v48.26,28.69 48.26,29.43 C37.1
  Bottom 0.254: v32.07,7.94 33.02,6.99 33.02,3.17 33.66,2.54 v54.61,2.54 | v48.26,28.69 v53.23,28.69
PC3/ADC13  (via drill 0.5)
  Top 0.254: RN7.4 43.18,55.65 43.18,54.61 v43.81,53.98 | v39.37,29.21 39.39,29.19 IC4.11 43.26,29.19 C29.1
  Bottom 0.254: v43.81,53.98 43.81,52.07 39.37,47.62 v39.37,29.21
PC4/ADC14  (via drill 0.5)
  Top 0.254: RN7.3 42.31,54.21 v42.55,53.98 | v36.2,31.11 35.81,31.5 IC4.24 35.81,34.67 33.66,36.83 33.44,36.83 C30.1
  Bottom 0.254: v42.55,53.98 43.18,53.34 43.18,52.7 38.73,48.26 38.73,33.66 v36.2,31.11
PC5/ADC15  (via drill 0.5)
  Top 0.254: v42.55,41.27 32.38,41.27 31.11,40.01 31.11,37.47 31.75,36.83 32.38,36.83 33.02,36.2 33.66,36.2 35.31,34.54 IC4.25 | v46.35,12.38 46.99,12.38 47.86,11.51 RN2.3
  Bottom 0.254: v46.35,12.38 46.35,13.34 45.72,13.97 45.72,38.73 43.18,41.27 v42.55,41.27
PC6  (via drill 0.5)
  Top 0.254: IC4.37 28.31,29.69 25.61,32.38 C11.1 25.61,32.6 24.77,31.75 23.5,31.75 22.86,31.11 v22.86,23.81 | RN6.6 22.23,14.04 22.23,14.61 20.95,14.61 20.32,15.24 v20.32,20
  Top 0.305: RN5.3 RN6.6
  Bottom 0.254: v20.32,20 22.86,22.54 v22.86,23.81
PC7  (via drill 0.5)
  Top 0.254: IC4.38 27.96,29.19 26.67,30.48 C10.1 25.61,30.06 24.77,29.21 24.77,25.4 v24.13,24.77 | RN6.7 23.5,14.04 23.5,14.61 24.77,14.61 25.4,15.24 25.4,18.73 v24.13,20 | IC3.3 25.33,43.5 19.37,43.5 18.73,44.13 18.73,52.07 20.64,53.98 20.64,57.15 18.41,59.37 5.4,59.37 2.54,56.52 v2.54,47.47
  Top 0.305: RN5.2 RN6.7
  Bottom 0.254: v24.13,20 v24.13,24.77 23.5,24.77 23.18,25.08 22.23,25.08 21.91,24.77 4.76,24.77 2.54,26.99 v2.54,47.47
PC8  (via drill 0.5)
  Top 0.254: IC4.39 25.73,28.69 C9.1 25.61,24.98 v25.4,24.77 | RN6.8 24.23,13.97 25.08,13.97 26.04,14.92 v26.04,20.32
  Top 0.305: RN5.1 RN6.8
  Bottom 0.254: v26.04,20.32 25.4,20.95 v25.4,24.77
PC9  (via drill 0.5)
  Top 0.254: v13.97,57.47 R12.1 C25.1 18.1,53.12 18.1,48.58 | v31.43,27.94 31.18,28.19 IC4.40 | IC3.6 29.53,39.24 29.53,39.37 28.89,40.01 27.62,40.01 24.77,42.86 19.05,42.86 18.1,43.81 18.1,48.58 | 18.1,48.58 17.14,49.53 8.26,49.53 v7.3,48.58
  Bottom 0.254: JP1.5 v13.97,57.47 | v31.43,27.94 9.84,27.94 6.67,31.11 6.67,47.94 v7.3,48.58
PC10  (via drill 0.5)
  Top 0.254: RN2.4 46.26,10.16 v43.81,10.16 | v27.3,8.89 27.3,10.79 26.67,11.43 26.67,13.97 27.3,14.61 27.3,18.73 27.94,19.37 30.8,19.37 32.81,21.38 IC4.51
  Bottom 0.254: v43.81,10.16 42.55,8.89 v27.3,8.89
PC11  (via drill 0.5)
  Top 0.254: RN2.2 48.58,11.04 48.58,11.43 46.67,13.34 44.77,13.34 44.13,12.7 v42.86,12.7 | v39.21,15.72 40.96,17.46 v40.96,19.37 | IC4.52 33.34,22.27 33.34,23.02 32.54,23.81 32.54,24.13 33.81,25.4 36.83,25.4 37.78,24.45 v38.42,24.45
  Bottom 0.254: v42.86,12.7 42.23,13.34 41.59,13.34 v39.21,15.72 | v40.96,19.37 40.32,20 40.32,22.86 39.69,23.5 39.37,23.5 v38.42,24.45
PC12
  Top 0.254: ALIVE.C 32.38,18.52 32.38,20.32 33.02,20.95 33.34,20.95 33.81,21.43 IC4.53
PC13  (via drill 0.5)
  Top 0.254: RN1.1 41.27,11.03 41.27,13.34 43.18,15.24 v43.18,15.88 | IC4.2 43.89,24.69 44.45,24.13 44.45,20.64 43.18,19.37 v43.18,18.41
  Bottom 0.254: v43.18,15.88 v43.18,18.41
PD2/TIM3_ETR  (via drill 0.5)
  Top 0.254: R15.1 23.91,49.53 v28.26,49.53 | v33.66,24.13 34.31,23.48 IC4.54
  Bottom 0.254: v28.26,49.53 35.24,42.55 35.24,37.78 34.61,37.15 34.61,35.56 35.24,34.92 35.24,28.89 33.5,27.15 33.5,24.29 v33.66,24.13
PWM_USER
  Top 0.406: JP2.20 52.07,6.99 49.7,9.36 RN2.8
R1
  Top 0.305: R19.2 36.55,57.09 IC5.1 34.63,63.16 JP1.13
R2
  Top 0.305: JP1.12 32.09,63.16 32.09,59.05 | 32.09,59.05 IC5.3 | R22.2 28.57,57.37 28.57,58.42 29.21,59.05 32.09,59.05
RES_BIAS  (via drill 0.5)
  Top 0.305: R3.1 R7.2 C7.1 44.45,58.84 v44.45,59.69
  Bottom 0.254: v44.45,59.69 41.91,62.23 JP1.16
SIG_BMS
  Top 0.254: RN5.8 24.13,9.29 24.13,8.26 26.67,5.71 JP2.10
SIG_BRAKE
  Top 0.305: JP2.6 15.64,5.95 RN3.3
SIG_CRUISE  (via drill 0.6)
  Top 0.254: SJ3.1 16.51,18.57 v16.67,18.73
  Top 0.305: JP2.4 11.43,6.99 13.8,9.36 RN3.1
  Bottom 0.254: v16.67,18.73 14.76,18.73 11.59,15.56 11.59,5.24 JP2.4
SIG_EMCYSTOP
  Top 0.305: JP2.9 23.26,5.95 RN5.7
SIG_FORWARD
  Top 0.305: JP2.7 19.05,6.99 21.43,9.36 RN5.5
SIG_REVERSE
  Top 0.305: JP2.8 22.46,5.95 RN5.6
SIG_START
  Top 0.305: JP2.5 14.84,5.95 RN3.2
THROTTLE1
  Top 0.406: JP2.12 31.05,5.79 RN8.8
THROTTLE2
  Top 0.406: JP2.11 30.25,6.12 RN8.7
TIM1_CH1N  (via drill 0.5)
  Top 0.305: v28.57,31.75 29.14,31.19 IC4.34
  Bottom 0.254: 17.14,59.05 17.14,34.29 19.68,31.75 v28.57,31.75
  Bottom 0.305: JP1.7 19.05,60.96 17.14,59.05
TIM1_CH2N  (via drill 0.5)
  Top 0.254: IC4.35 30.69,30.69 31.43,31.43 v31.43,31.75
  Bottom 0.254: 24.77,37.47 30.48,31.75 v31.43,31.75
  Bottom 0.305: JP1.9 24.77,62.87 24.77,37.47
TIM1_CH3N  (via drill 0.5)
  Top 0.254: v26.04,38.1 26.04,34.29 27.3,33.02 27.3,31.75 28.86,30.19 IC4.36
  Bottom 0.254: JP1.11 29.21,60.96 26.04,57.78 v26.04,38.1
TMPHS
  Top 0.305: JP1.17 43.81,62.87 43.81,62.23 42.31,60.73 RN7.6
UDC
  Top 0.305: JP1.18 46.35,62.87 46.35,61.59 45.72,60.96 43.81,60.96 43.11,60.26 RN7.5
VCC  (via drill 0.5, 0.6)
  Top 0.254: R4.1 4.45,32.04 4.45,36.2 6.09,37.84 L1.2 | R12.2 v18.73,57.47 | R6.2 37.47,9.31 v37.47,7.94 | 41.86,52.7 39.6,50.45 C39.+
  Top 0.305: IC2.3 v50.16,46.99 | 41.86,52.7 v41.91,52.7 45.72,52.7 46.35,53.34 46.35,54.4 R3.2 | IC5.2 33.36,54.9 34.29,53.98 35.98,53.98 C40.2 36.62,52.28 39.27,49.62 C39.+
  Top 0.406: C6.1 14.82,37.47 15.24,37.47 18.25,34.46 IC1.3
  Top 1.016: v8.26,40.01 8.26,38.24 L1.2 8.81,37.68 C5.1 C6.1
  Bottom 0.254: v18.73,57.47 19.05,57.47 | v37.47,7.94 37.47,7.62
  Bottom 0.305: v50.16,46.99 50.16,47.62 | v41.91,52.7 42.55,52.7
  Bottom 1.016: v8.26,40.01 7.62,40.01
  pour Bottom: 1.27,66.04 55.88,66.04 55.89,46.36 19.05,46.36 19.05,12.36 55.89,12.34 55.89,0.64 1.27,0.64
VCCIO  (via drill 0.5, 0.6)
  Top 0.254: IC4.19 38.31,36.83 C20.2 39.59,38.1 40.64,38.1 41.27,38.73 v42.55,38.73 | IC4.32 30.91,33.64 C21.2 29.62,34.92 29.21,34.92 v28.57,35.56 28.57,38.94 IC3.5 | L2.2 v47.31,34.29 | IC4.48 29.86,22.66 C19.2 29.21,22.01 v29.21,20.95 | 41.68,22.24 41.26,22.66 IC4.1 | 41.68,22.24 C18.2 41.91,22.01 v41.91,20.95 | R8.1 29.21,16.34 29.21,17.14 29.84,17.78 v29.84,18.41 | C4.1 v24.13,18.41 | 41.68,22.24 IC4.64 | R10.2 52.07,40.6 v52.07,39.69 | v33.97,42.23 v43.81,42.23 | J1.1 49.21,18.87 v49.21,20.64
  Top 0.406: IC1.2 18.62,36.77 L3.1 18.66,38.69 R1.1 23.45,36.2 v23.5,36.2
  Bottom 0.254: v28.57,35.56 28.57,36.2 | v47.31,34.29 47.62,34.29 | v29.21,20.95 28.57,20.95 | v41.91,20.95 41.91,20.32 | v29.84,18.41 30.48,19.05 | v24.13,18.41 24.13,17.78 | v42.55,38.73 42.55,39.37 | v52.07,39.69 52.07,39.37 | 33.66,42.23 v33.97,42.23 | v43.81,42.23 44.13,41.91 | v49.21,20.64 49.85,21.27 49.85,21.91
  Bottom 0.406: v23.5,36.2 23.5,35.56
  pour Bottom: 55.89,45.42 19.99,45.42 19.99,13.28 55.89,13.28

### Text on the board
tNames: 1 | openinverter.org mainboard mini v1.1 | 1 | (C) 2020 Johannes Huebner
bStop: (c) 2020 Johannes Huebner / openinverter.org